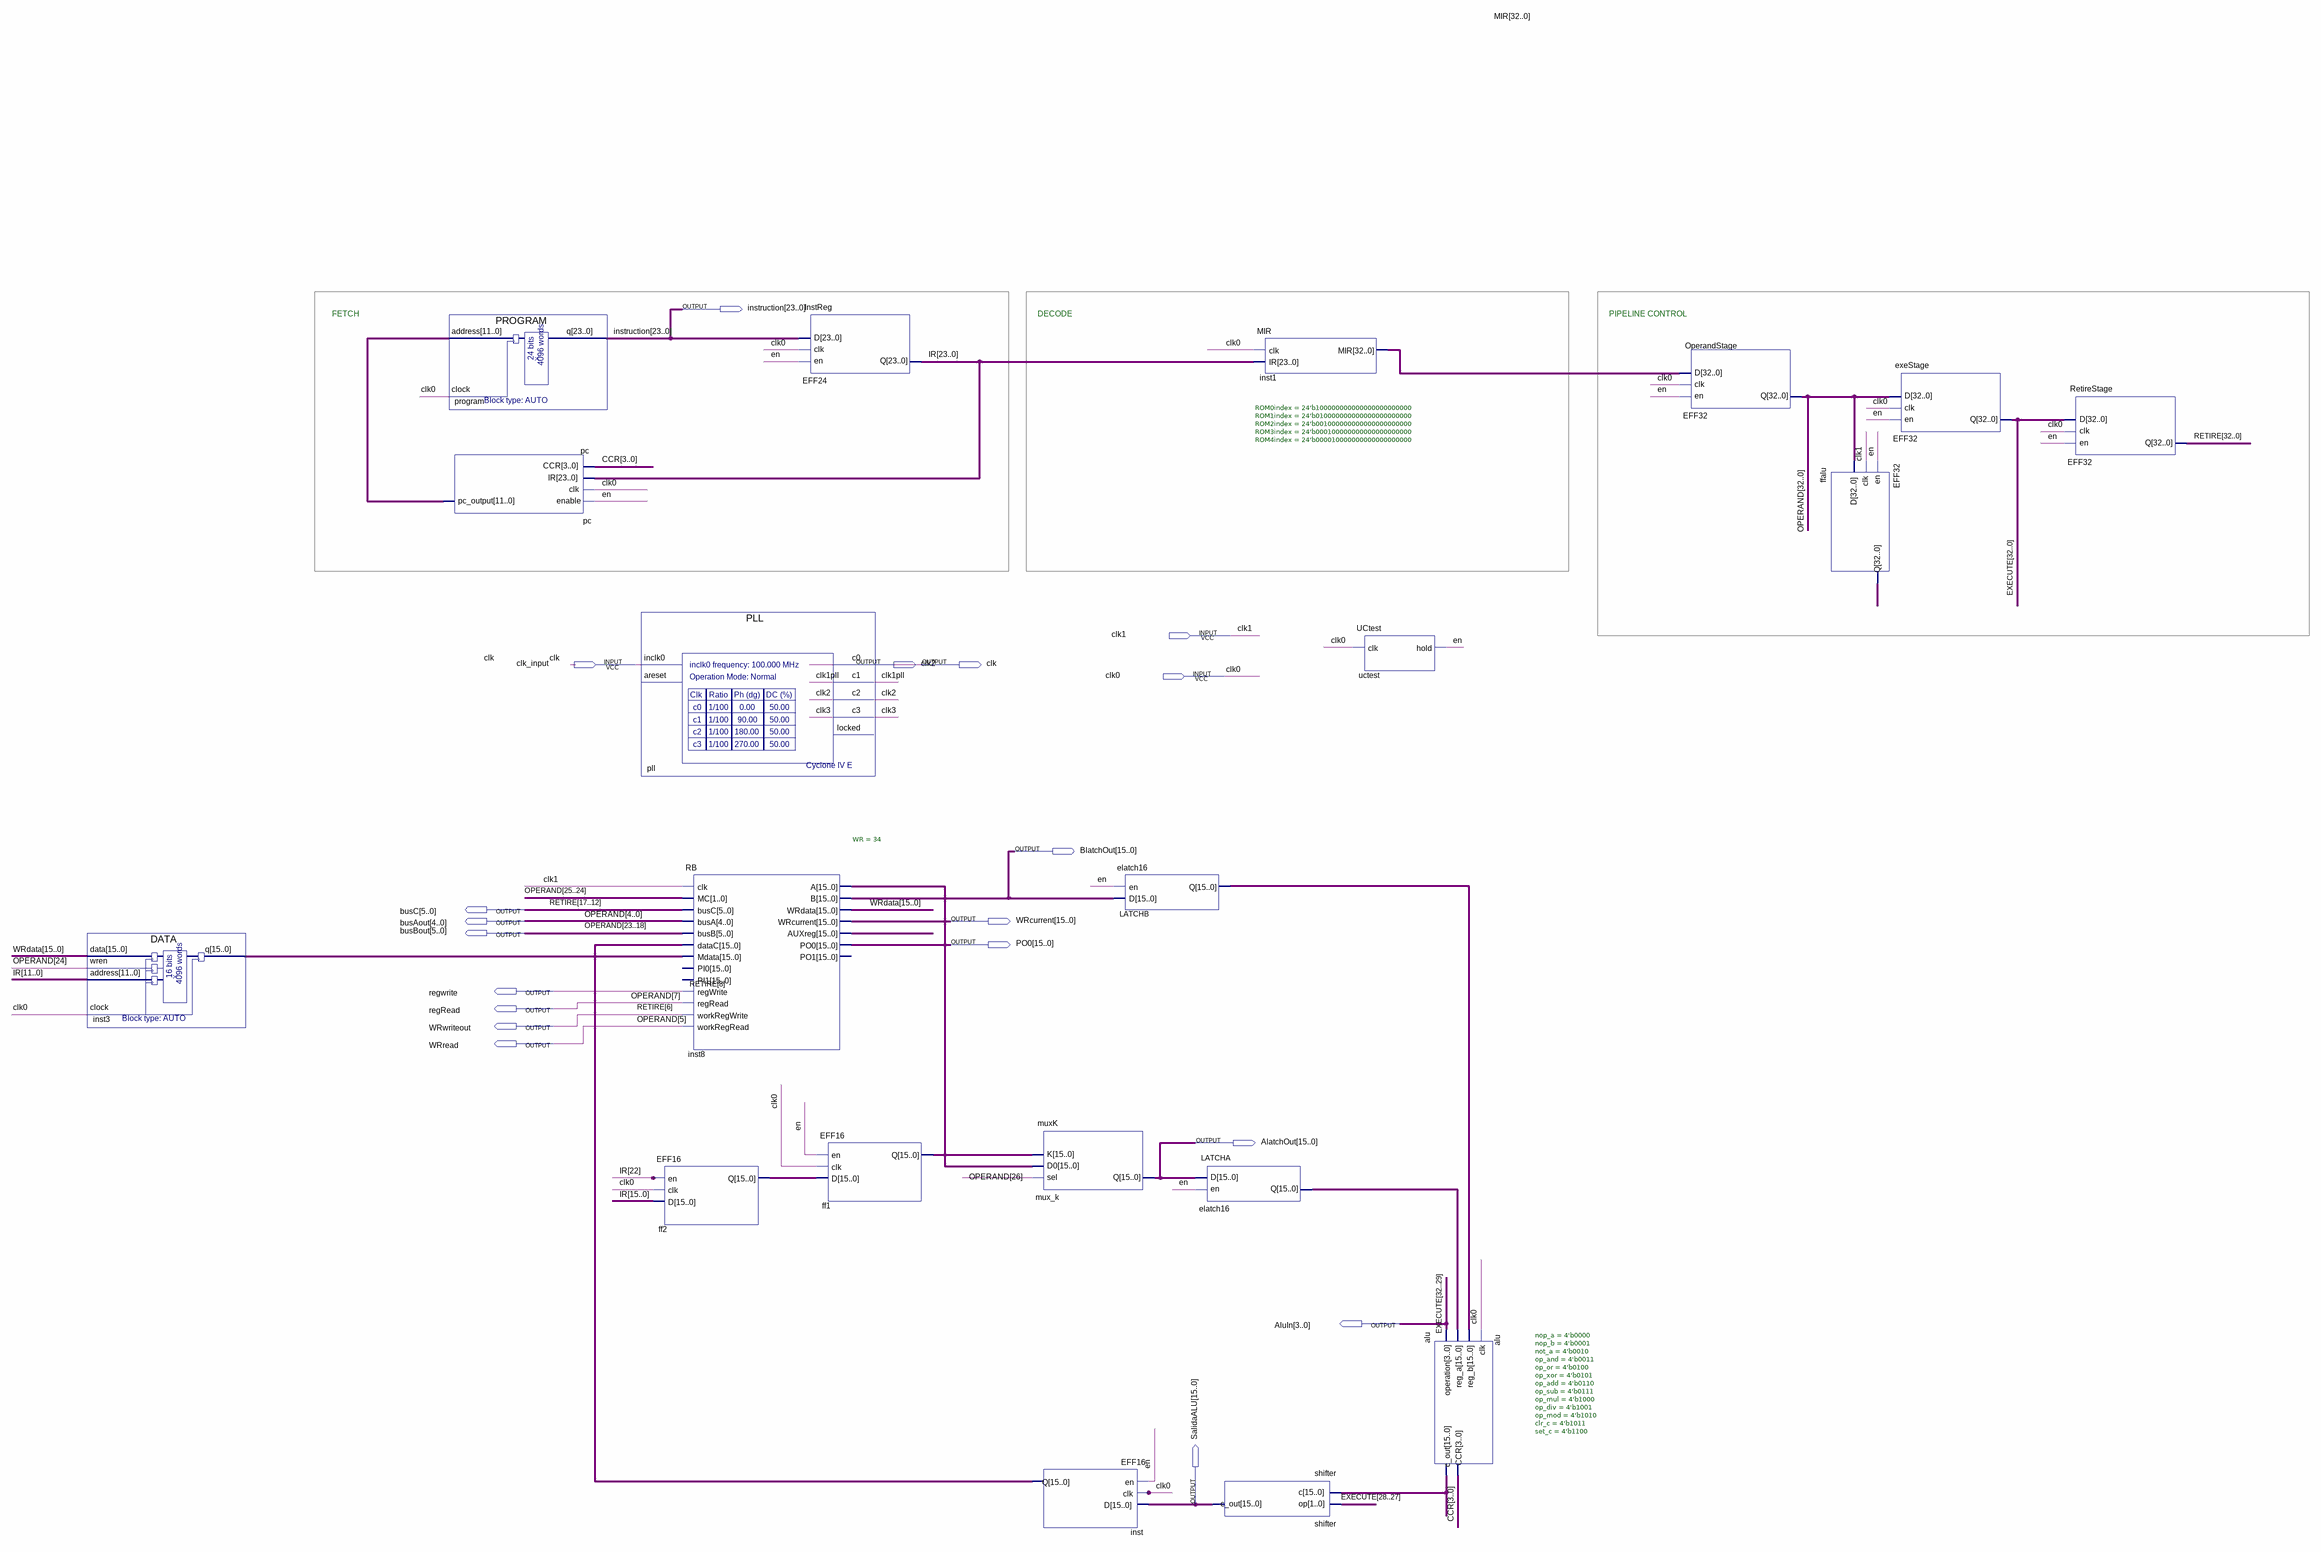
[diagram p0: schematic sheet]
// Quartus schematic EV22G5.bdf as structural Verilog: 20 symbols, 19 pins
module EV22G5 (
  input  clk1,
  input  clk_input,
  input  clk0,
  output [23:0] instruction,
  output clk2,
  output clk,
  output [15:0] BlatchOut,
  output [5:0] busC,
  output [4:0] busAout,
  output [15:0] WRcurrent,
  output [5:0] busBout,
  output [15:0] PO0,
  output regwrite,
  output regRead,
  output WRwriteout,
  output WRread,
  output [15:0] AlatchOut,
  output [3:0] AluIn,
  output [15:0] SalidaALU
);

  wire clk1pll, clk3, en;
  wire [3:0] CCR;
  wire [11:0] pc_pc_output;
  wire [15:0] alu_c_out, ff1_q, ff2_q, inst3_q, inst8_a, inst8_auxreg, inst_q, LATCHA_q, LATCHB_q, WRdata;
  wire [23:0] IR;
  wire [28:0] EXECUTE;
  wire [32:0] ffalu_q, MIR, RETIRE;
  wire [32:6] OPERAND;

  DATA inst3 (.data(WRdata), .wren(OPERAND[24]), .address(IR[11:0]), .clock(clk0), .q(inst3_q));
  pc pc (.enable(en), .clk(clk0), .IR(IR), .CCR(CCR), .pc_output(pc_pc_output));
  PROGRAM \program  (.address(pc_pc_output), .clock(clk0), .q(instruction));
  PLL pll (.inclk0(clk_input), .c0(clk), .c1(clk1pll), .c2(clk), .c3(clk3));  // open: areset, locked
  EFF16 ff2 (.en(IR[22]), .clk(clk0), .D(IR[15:0]), .Q(ff2_q));
  RB #(.WR(34)) inst8 (
    .clk(clk1), .MC(OPERAND[25:24]), .busC(busC), .busA(busAout), .busB(busBout), .dataC(inst_q),
    .Mdata(inst3_q), .regWrite(regwrite), .regRead(regRead), .workRegWrite(WRwriteout), .workRegRead(WRread),
    .A(inst8_a), .B(BlatchOut), .WRdata(WRdata), .WRcurrent(WRcurrent), .AUXreg(inst8_auxreg), .PO0(PO0));  // open: PI0, PI1, PO1
  EFF24 InstReg (.en(en), .clk(clk0), .D(instruction), .Q(IR));
  EFF16 ff1 (.en(en), .clk(clk0), .D(ff2_q), .Q(ff1_q));
  mux_k muxK (.sel(OPERAND[26]), .D0(inst8_a), .K(ff1_q), .Q(AlatchOut));
  EFF16 inst (.en(en), .clk(clk0), .D(SalidaALU), .Q(inst_q));
  elatch16 LATCHB (.en(en), .D(BlatchOut), .Q(LATCHB_q));
  elatch16 LATCHA (.en(en), .D(AlatchOut), .Q(LATCHA_q));
  shifter shifter (.op(EXECUTE[28:27]), .c(alu_c_out), .c_out(SalidaALU));
  MIR #(.ROM0index(24'b100000000000000000000000), .ROM1index(24'b010000000000000000000000), .ROM2index(24'b001000000000000000000000), .ROM3index(24'b000100000000000000000000), .ROM4index(24'b000010000000000000000000)) inst1 (
    .clk(clk0), .IR(IR), .MIR(MIR));
  UCtest uctest (.clk(clk0), .hold(en));
  alu #(.nop_a(4'b0000), .nop_b(4'b0001), .not_a(4'b0010), .op_and(4'b0011), .op_or(4'b0100), .op_xor(4'b0101), .op_add(4'b0110), .op_sub(4'b0111), .op_mul(4'b1000), .op_div(4'b1001), .op_mod(4'b1010), .clr_c(4'b1011), .set_c(4'b1100)) alu (
    .operation(AluIn), .reg_a(LATCHA_q), .reg_b(LATCHB_q), .clk(clk0), .c_out(alu_c_out), .CCR(CCR));
  EFF32 OperandStage (
    .en(en), .clk(clk0), .D(MIR),
    .Q({OPERAND[32:24], busBout, OPERAND[17:8], regRead, OPERAND[6], WRread, busAout}));
  EFF32 ffalu (
    .en(en), .clk(clk1), .D({OPERAND[32:24], busBout, OPERAND[17:8], regRead, OPERAND[6], WRread, busAout}),
    .Q(ffalu_q));
  EFF32 exeStage (
    .en(en), .clk(clk0), .D({OPERAND[32:24], busBout, OPERAND[17:8], regRead, OPERAND[6], WRread, busAout}),
    .Q({AluIn, EXECUTE}));
  EFF32 RetireStage (
    .en(en), .clk(clk0), .D({AluIn, EXECUTE}),
    .Q({RETIRE[32:18], busC, RETIRE[11:9], regwrite, RETIRE[7], WRwriteout, RETIRE[5:0]}));

  assign clk2 = clk;

  // Other names for the same wires on the sheet: EXECUTE[32:29] = AluIn;
  //   OPERAND (some bits) = {busBout, regRead, WRread, busAout}; RETIRE (some bits) = {busC, regwrite, WRwriteout}

  // Notes on the sheet:
  //   FETCH
  //   DECODE 
  //   PIPELINE CONTROL 
endmodule
